# EAGLE design Preston_PIC (EAGLE 5.12)
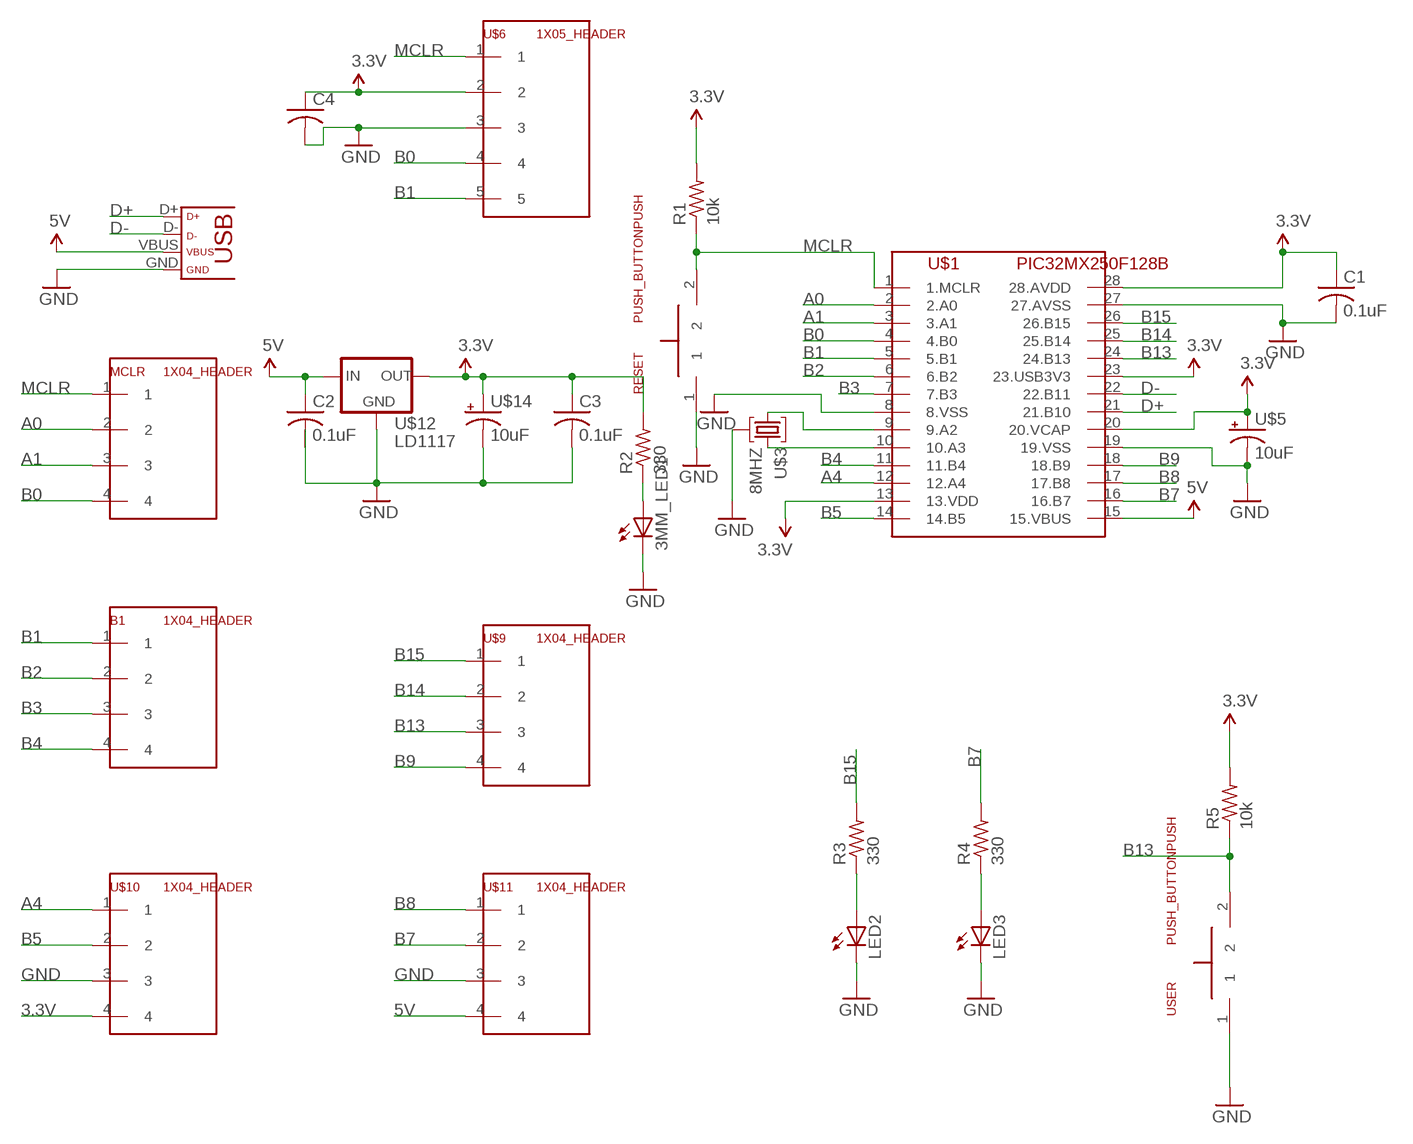
[diagram p0: schematic, sheet 1]

## Parts
3MM_LED1  LED3MM  [LED3MM]
B1  1X04_HEADER  [1X04]
C1  0.1uF  C-US025-025X050  [C025-025X050]
C2  0.1uF  C-US025-025X050  [C025-025X050]
C3  0.1uF  C-US025-025X050  [C025-025X050]
C4  C-US025-025X050  [C025-025X050]
LED2  LED3MM  [LED3MM]
LED3  LED3MM  [LED3MM]
MCLR  1X04_HEADER  [1X04]
R1  10k  R-US_0207/10  [0207/10]
R2  330  R-US_0207/10  [0207/10]
R3  330  R-US_0207/10  [0207/10]
R4  330  R-US_0207/10  [0207/10]
R5  10k  R-US_0207/10  [0207/10]
RESET  PUSH_BUTTONPUSH  [PUSH_BUTTON]
U$1  PIC32MX250F128B  [DIL28-3]
U$3  8MHZ  8MHZ_CRYSTAL  [8MHZ_CRYSTAL]
U$5  10uF  CAP_POL  [CAP_POL_D]
U$6  1X05_HEADER  [1X05]
U$9  1X04_HEADER  [1X04]
U$10  1X04_HEADER  [1X04]
U$11  1X04_HEADER  [1X04]
U$12  LD1117  [TO220]
U$14  10uF  CAP_POL  [CAP_POL_D]
U$16  USB  [USB-MINIB]
USER  PUSH_BUTTONPUSH  [PUSH_BUTTON]

## Nets
3.3V: C1.1 C3.1 C4.1 R1.2 R2.2 R5.2 U$1.13(13.VDD) U$1.20(20.VCAP) U$1.23(23.USB3V3) U$1.28(28.AVDD) U$5.1(+) U$6.2 U$10.4 U$12.2(OUT) U$14.1(+)
5V: C2.1 U$1.15(15.VBUS) U$11.4 U$12.3(IN) U$16.VBUS
A0: MCLR.2 U$1.2(2.A0)
A1: MCLR.3 U$1.3(3.A1)
A4: U$1.12(12.A4) U$10.1
B0: MCLR.4 U$1.4(4.B0) U$6.4
B1: B1.1 U$1.5(5.B1) U$6.5
B2: B1.2 U$1.6(6.B2)
B3: B1.3 U$1.7(7.B3)
B4: B1.4 U$1.11(11.B4)
B5: U$1.14(14.B5) U$10.2
B7: R4.2 U$1.16(16.B7) U$11.2
B8: U$1.17(17.B8) U$11.1
B9: U$1.18(18.B9) U$9.4
B13: R5.1 U$1.24(24.B13) U$9.3 USER.2
B14: U$1.25(25.B14) U$9.2
B15: R3.2 U$1.26(26.B15) U$9.1
D+: U$1.21(21.B10) U$16.D+
D-: U$1.22(22.B11) U$16.D-
GND: 3MM_LED1.K(C) C1.2 C3.2 C4.2 LED2.K(C) LED3.K(C) RESET.1 U$1.8(8.VSS) U$1.19(19.VSS) U$1.27(27.AVSS) U$3.2.FREQUENCY U$5.2(-) U$6.3 U$10.3 U$11.3 U$12.1(GND) U$14.2(-) U$16.GND USER.1
MCLR: MCLR.1 R1.1 RESET.2 U$1.1(1.MCLR) U$6.1
N$6: U$1.9(9.A2) U$3.1.GND
N$7: U$1.10(10.A3) U$3.3.VDD
N$10: LED2.A R3.1
N$11: LED3.A R4.1
N$13: 3MM_LED1.A R2.1
Unconnected: C2.2

## Library data of the parts
3MM_LED1 LED2 LED3 = Preston_ME433:LED: LED OSRAM: - CHIPLED LG R971, LG N971, LY N971, LG Q971, LY Q971, LO R971, LY R971 LH N974, LH R974 LS Q976, LO Q976, LY Q976 LO Q996 - Hyper CHIPLED LW Q18S LB Q993, LB Q99A, LB R99A - SideLED LS A670, LO A670, LY A670, LG A670, LP A670 LB A673, LV A673, LT A673, LW A673 LH A674 LY A675 LS A676, LA A676, LO A676, LY A676, LW A676 LS A679, LY A679, LG A679 - Hyper Micro SIDELED® LS Y876, LA Y876, LO Y876, LY Y876 LT Y87S - SmartLED LW L88C, LW L88S LB L89C, LB L89S, LG L890 LS L89K, LO L89K, LY L89K LS L896, LA L896, LO L896, LY L896 - TOPLED LS T670, LO T670, LY T670, LG T670, LP T670 LSG T670, LSP T670, LSY T670, LOP T670, LYG T670 LG T671, LOG T671, LSG T671 LB T673, LV T673, LT T673, LW T673 LH T674 LS T676, LA T676, LO T676, LY T676, LB T676, LH T676, LSB T676, LW T676 LB T67C, LV T67C, LT T67C, LS T67K, LO T67K, LY T67K, LW E67C LS E67B, LA E67B, LO E67B, LY E67B, LB E67C, LV E67C, LT E67C LW T67C LS T679, LY T679, LG T679 LS T770, LO T770, LY T770, LG T770, LP T770 LB T773, LV T773, LT T773, LW T773 LH T774 LS E675, LA E675, LY E675, LS T675 LS T776, LA T776, LO T776, LY T776, LB T776 LHGB T686 LT T68C, LB T68C - Hyper Mini TOPLED® LB M676 - Mini TOPLED Santana® LG M470 LS M47K, LO M47K, LY M47K Source: http://www.osram.convergy.de LUXEON: - LUMILED® LXK2-PW12-R00, LXK2-PW12-S00, LXK2-PW14-U00, LXK2-PW14-V00 LXK2-PM12-R00, LXK2-PM12-S00, LXK2-PM14-U00 LXK2-PE12-Q00, LXK2-PE12-R00, LXK2-PE12-S00, LXK2-PE14-T00, LXK2-PE14-U00 LXK2-PB12-K00, LXK2-PB12-L00, LXK2-PB12-M00, LXK2-PB14-N00, LXK2-PB14-P00, LXK2-PB14-Q00 LXK2-PR12-L00, LXK2-PR12-M00, LXK2-PR14-Q00, LXK2-PR14-R00 LXK2-PD12-Q00, LXK2-PD12-R00, LXK2-PD12-S00 LXK2-PH12-R00, LXK2-PH12-S00 LXK2-PL12-P00, LXK2-PL12-Q00, LXK2-PL12-R00 Source: www.luxeon.com KINGBRIGHT: KA-3528ASYC Source: www.kingbright.com
B1 MCLR U$9-U$11 = Preston_ME433:1X04_HEADER
C1-C4 = Preston_ME433:C-US: CAPACITOR, American symbol
R1-R5 = Preston_ME433:R-US_: RESISTOR, American symbol
RESET USER = Preston_ME433:PUSH_BUTTON
U$1 = Preston_ME433:PIC32MX250F128B
U$3 = Preston_ME433:8MHZ_CRYSTAL
U$5 U$14 = Preston_ME433:CAP_POL
U$6 = Preston_ME433:1X05_HEADER
U$12 = Preston_ME433:LD1117
U$16 = Preston_ME433:USB

## Board
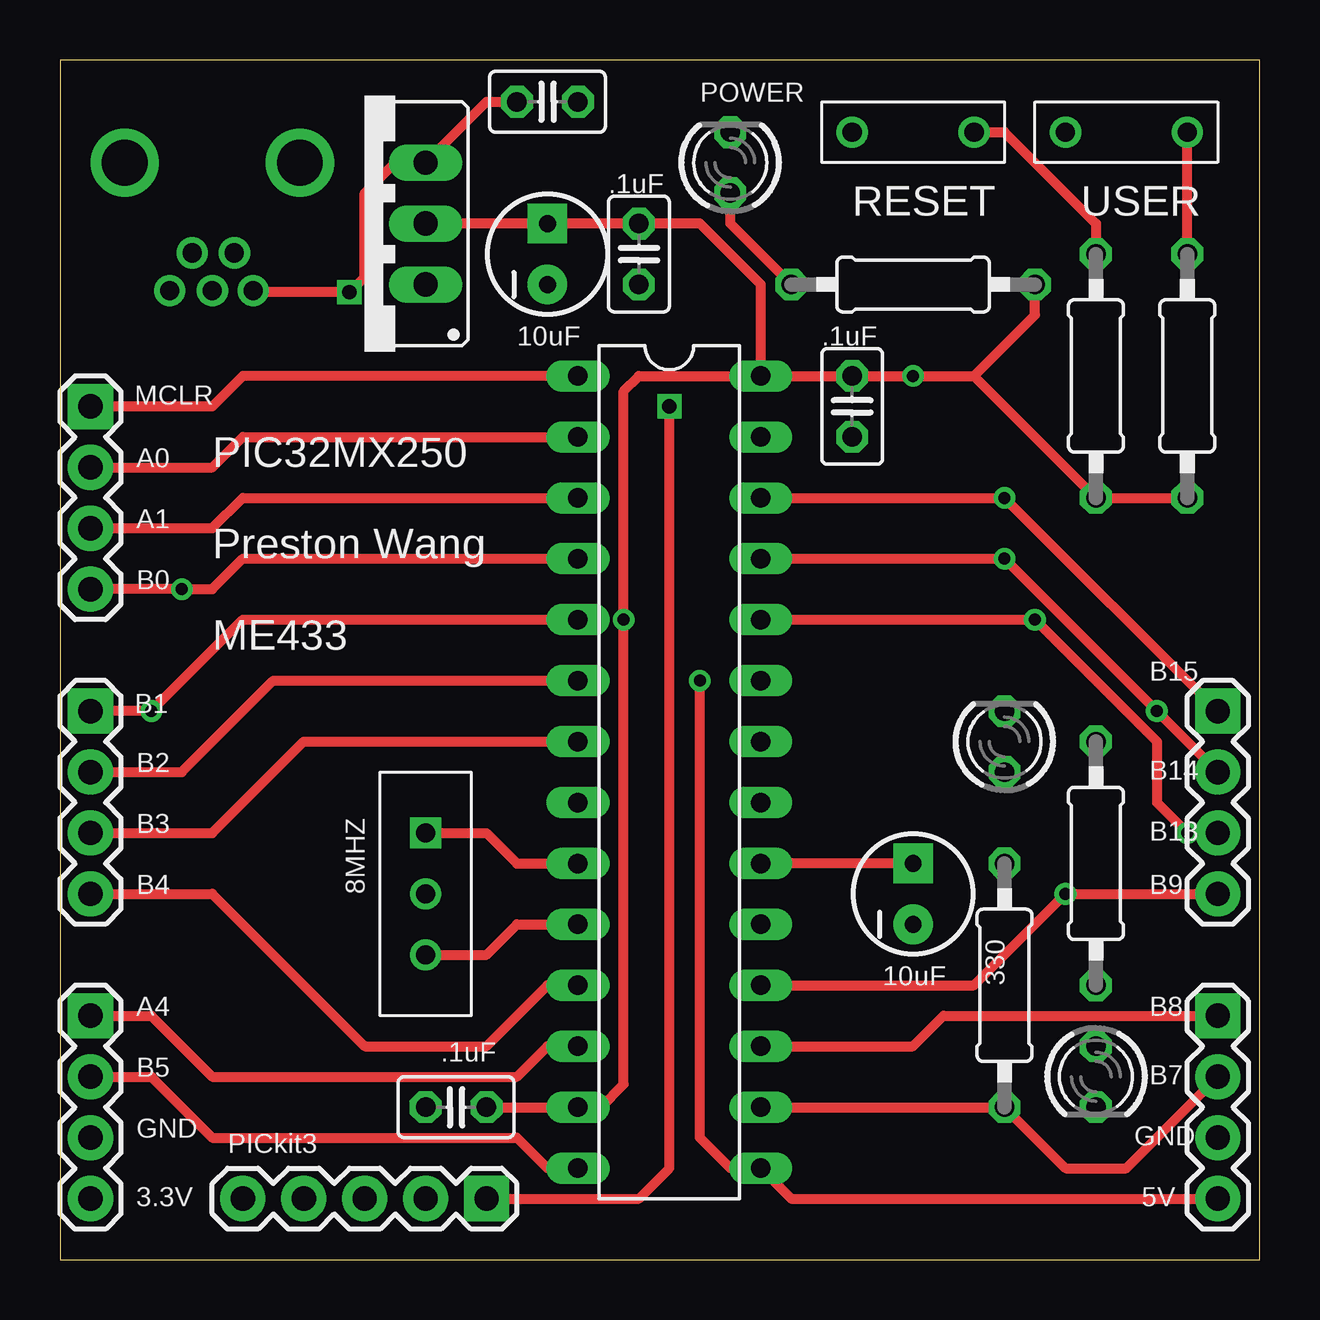
[diagram p1: board, top side]
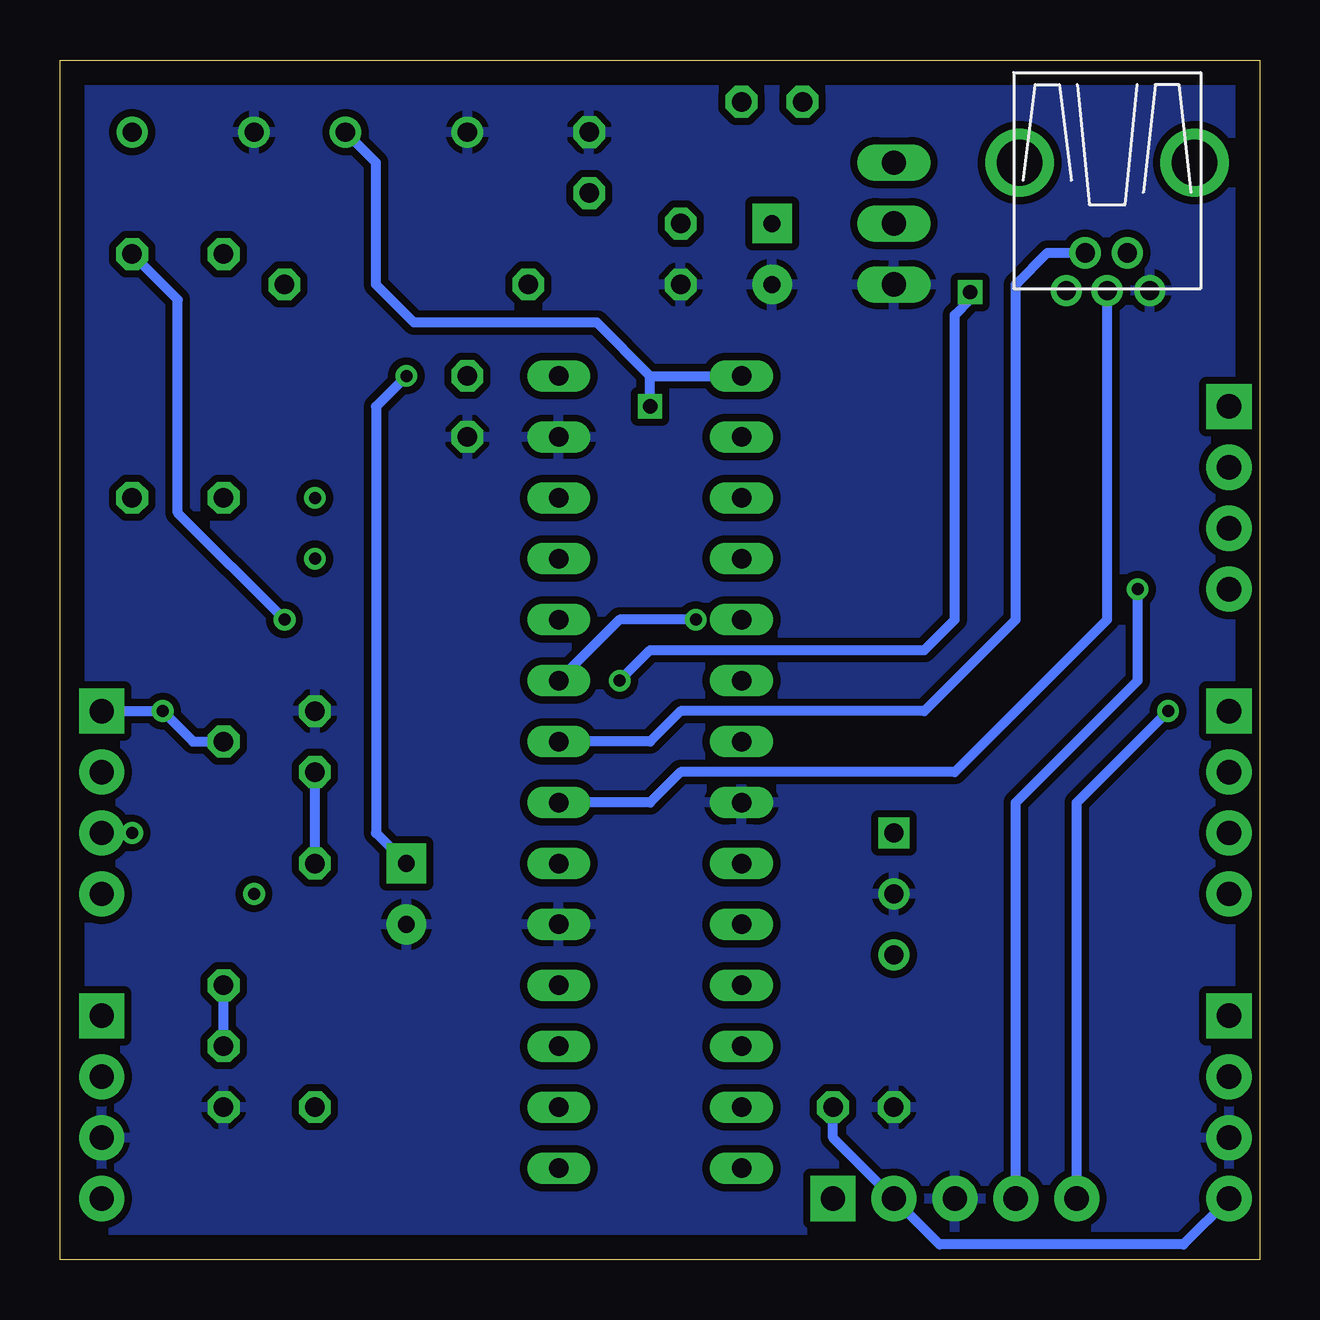
[diagram p2: board, bottom side, seen from below]

Size 50 x 50 mm. Coordinates in mm from the lower left corner, seen from the top.
Outline: 0,0 50,0 50,50 0,50 0,0
Copper layers (1*16): Top 0.035mm / dielectric 1.5mm / Bottom 0.035mm
Design rules "default": minimum track width 10mil, minimum drill 24mil, track to track 8mil, track to pad 8mil, pad to pad 8mil, via to via 8mil, smd to smd 8mil, copper to edge 40mil, drill to drill 8mil, minimum pad ring 10mil, minimum via ring 8mil, stop-mask expansion 4mil, vias tented up to drill 0mil, thermal gap 10mil

### Footprints (pad centres in the part's own frame; a part is rotated, then mirrored left to right if it is on the bottom)
LED3MM = drill 0.813 octagon: A -1.27,0; K 1.27,0
1X04 = drill 1.016 pad 1.88 square: 1 0,0 | drill 1.016 pad 1.88 round: 2 2.54,0; 3 5.08,0; 4 7.62,0
C025-025X050 = drill 0.813 octagon: 1 -1.27,0; 2 1.27,0
0207/10 = drill 0.813 octagon: 1 -5.08,0; 2 5.08,0
PUSH_BUTTON = drill 0.8 round: 1 -2.54,0; 2 2.54,0
DIL28-3 = drill 0.813 long: 1 -16.51,-3.81; 2 -13.97,-3.81; 3 -11.43,-3.81; 4 -8.89,-3.81; 5 -6.35,-3.81; 6 -3.81,-3.81; 7 -1.27,-3.81; 8 1.27,-3.81; 9 3.81,-3.81; 10 6.35,-3.81; 11 8.89,-3.81; 12 11.43,-3.81; 13 13.97,-3.81; 14 16.51,-3.81; 15 16.51,3.81; 16 13.97,3.81; 17 11.43,3.81; 18 8.89,3.81; 19 6.35,3.81; 20 3.81,3.81; 21 1.27,3.81; 22 -1.27,3.81; 23 -3.81,3.81; 24 -6.35,3.81; 25 -8.89,3.81; 26 -11.43,3.81; 27 -13.97,3.81; 28 -16.51,3.81
8MHZ_CRYSTAL = drill 0.8 square: 1.GND -2.54,2.54 | drill 0.8 round: 2.FREQUENCY 0,2.54; 3.VDD 2.54,2.54
CAP_POL_D = drill 0.7 pad 1.651 square: 1 1.27,0 | drill 0.7 pad 1.651 round: 2 -1.27,0
1X05 = drill 1.016 pad 1.88 square: 1 0,0 | drill 1.016 pad 1.88 round: 2 2.54,0; 3 5.08,0; 4 7.62,0; 5 10.16,0
TO220 = drill 1.016 long: 1 -2.54,0; 2 0,0; 3 2.54,0
USB-MINIB = drill 0.8 round: D+ 4.064,0; D- 2.489,0.914; GND 4.064,-1.778; ID 2.489,-0.838; VBUS 4.064,1.702 | drill 1.9 round: P$6 -1.27,-3.65; P$7 -1.27,3.65

### Placement (x,y rotation side)
3MM_LED1  27.94,45.72 90 top
B1  1.27,22.86 270 top
C1  24.13,41.91 270 top
C2  20.32,48.26 0 top
C3  33.02,35.56 270 top
C4  16.51,6.35 180 top
LED2  43.18,7.62 270 top
LED3  39.37,21.59 90 top
MCLR  1.27,35.56 270 top
R1  43.18,36.83 270 top
R2  35.56,40.64 0 top
R3  43.18,16.51 90 top
R4  39.37,11.43 270 top
R5  46.99,36.83 270 top
RESET  35.56,46.99 0 top
U$1  25.4,20.32 270 top
U$3  12.7,15.24 270 top
U$5  35.56,15.24 90 top
U$6  17.78,2.54 180 top
U$9  48.26,22.86 270 top
U$10  1.27,10.16 270 top
U$11  48.26,10.16 270 top
U$12  15.24,43.18 90 top
U$14  20.32,41.91 90 top
U$16  6.35,44.45 270 top
USER  44.45,46.99 0 top

### Tracks (layer width: path | path; a pad name or v marks a point on that pad's centre or on a via)
3.3V  (via drill 0.5)
  Top 0.406: U$12.2 U$14.1 C1.1 26.67,43.18 29.21,40.64 U$1.28 | U$1.28 C3.1 v35.56,36.83 38.1,36.83 | 38.1,36.83 R1.2 R5.2 | 38.1,36.83 40.64,39.37 R2.2 | C4.1 U$1.13 22.54,6.35 23.5,7.3 v23.5,26.67 23.5,36.2 24.13,36.83 U$1.28 | U$5.1 U$1.20
  Bottom 0.406: C4.1 17.78,5.08 U$6.2 13.34,0.64 3.17,0.64 U$10.4 | U$1.23 26.67,26.67 v23.5,26.67 | U$5.1 36.83,17.78 36.83,35.56 v35.56,36.83
5V  (via drill 0.5, 0.6)
  Top 0.406: C2.1 17.78,48.26 U$12.3 13.97,45.72 12.7,44.45 12.7,40.96 v12.06,40.32 8.12,40.32 U$16.VBUS | U$11.4 30.48,2.54 U$1.15 27.94,3.81 26.67,5.08 v26.67,24.13
  Bottom 0.406: v12.06,40.32 12.06,40.01 12.7,39.37 12.7,26.67 13.97,25.4 25.4,25.4 v26.67,24.13
A0
  Top 0.406: U$1.2 7.62,34.29 6.35,33.02 MCLR.2
A1
  Top 0.406: U$1.3 7.62,31.75 6.35,30.48 MCLR.3
A4
  Top 0.406: U$1.12 20.32,8.89 19.05,7.62 6.35,7.62 3.81,10.16 U$10.1
B0  (via drill 0.5)
  Top 0.406: U$1.4 7.62,29.21 6.35,27.94 v5.08,27.94 MCLR.4
  Bottom 0.406: v5.08,27.94 5.08,24.13 10.16,19.05 U$6.4
B1  (via drill 0.5)
  Top 0.406: U$1.5 7.62,26.67 v3.81,22.86 B1.1
  Bottom 0.406: v3.81,22.86 7.62,19.05 U$6.5
B2
  Top 0.406: U$1.6 8.89,24.13 5.08,20.32 B1.2
B3
  Top 0.406: U$1.7 10.16,21.59 6.35,17.78 B1.3
B4
  Top 0.406: U$1.11 20.32,11.43 17.78,8.89 12.7,8.89 6.35,15.24 B1.4
B5
  Top 0.406: U$10.2 3.81,7.62 6.35,5.08 19.05,5.08 20.32,3.81 U$1.14
B7
  Top 0.406: U$1.16 R4.2 41.91,3.81 44.45,3.81 U$11.2
B8
  Top 0.406: U$11.1 36.83,10.16 35.56,8.89 U$1.17
B9  (via drill 0.5)
  Top 0.406: U$1.18 38.1,11.43 v41.91,15.24 U$9.4
B13  (via drill 0.5)
  Top 0.406: R5.1 USER.2 | U$1.24 v40.64,26.67 45.72,21.59 45.72,19.05 v46.99,17.78 U$9.3
  Bottom 0.406: v40.64,26.67 45.09,31.11 45.09,40.01 R5.1
B14  (via drill 0.5)
  Top 0.406: U$1.25 v39.37,29.21 U$9.2
B15  (via drill 0.5)
  Top 0.406: U$1.26 v39.37,31.75 U$9.1
  Bottom 0.406: U$9.1 v45.72,22.86 44.45,21.59 R3.2
D+
  Bottom 0.406: U$16.D+ 6.35,26.67 12.7,20.32 24.13,20.32 25.4,19.05 U$1.21
D-
  Bottom 0.406: U$16.D- 8.84,41.96 10.16,40.64 10.16,26.67 13.97,22.86 24.13,22.86 25.4,21.59 U$1.22
GND
  pour Bottom (isolate 0.305): 0,0 50.8,0 50.8,49.53 0,49.53
MCLR  (via drill 0.6)
  Top 0.406: U$1.1 7.62,36.83 6.35,35.56 MCLR.1 | U$6.1 24.13,2.54 25.4,3.81 v25.4,35.56 | R1.1 43.18,43.18 39.37,46.99 RESET.2
  Bottom 0.406: v25.4,35.56 25.4,36.83 | 25.4,36.83 U$1.1 | 25.4,36.83 27.62,39.05 35.24,39.05 36.83,40.64 36.83,45.72 RESET.2
N$6
  Top 0.406: U$3.1.GND 17.78,17.78 19.05,16.51 U$1.9
N$7
  Top 0.406: U$3.3.VDD 17.78,12.7 19.05,13.97 U$1.10
N$10
  Bottom 0.406: LED2.A R3.1
N$11
  Bottom 0.406: R4.1 LED3.A
N$13
  Top 0.406: 3MM_LED1.A 27.94,43.18 R2.1

### Text on the board
tPlace: POWER | .1uF | 10uF | .1uF | A0 | PIC32MX250 | A1 | Preston Wang | B0 | ME433 | B15 | B2 | B14 | B3 | B13 | B4 | 8MHZ | B9 | 10uF | 330 | A4 | B8 | B5 | .1uF | B7 | GND | GND | PICkit3 | 3.3V | 5V